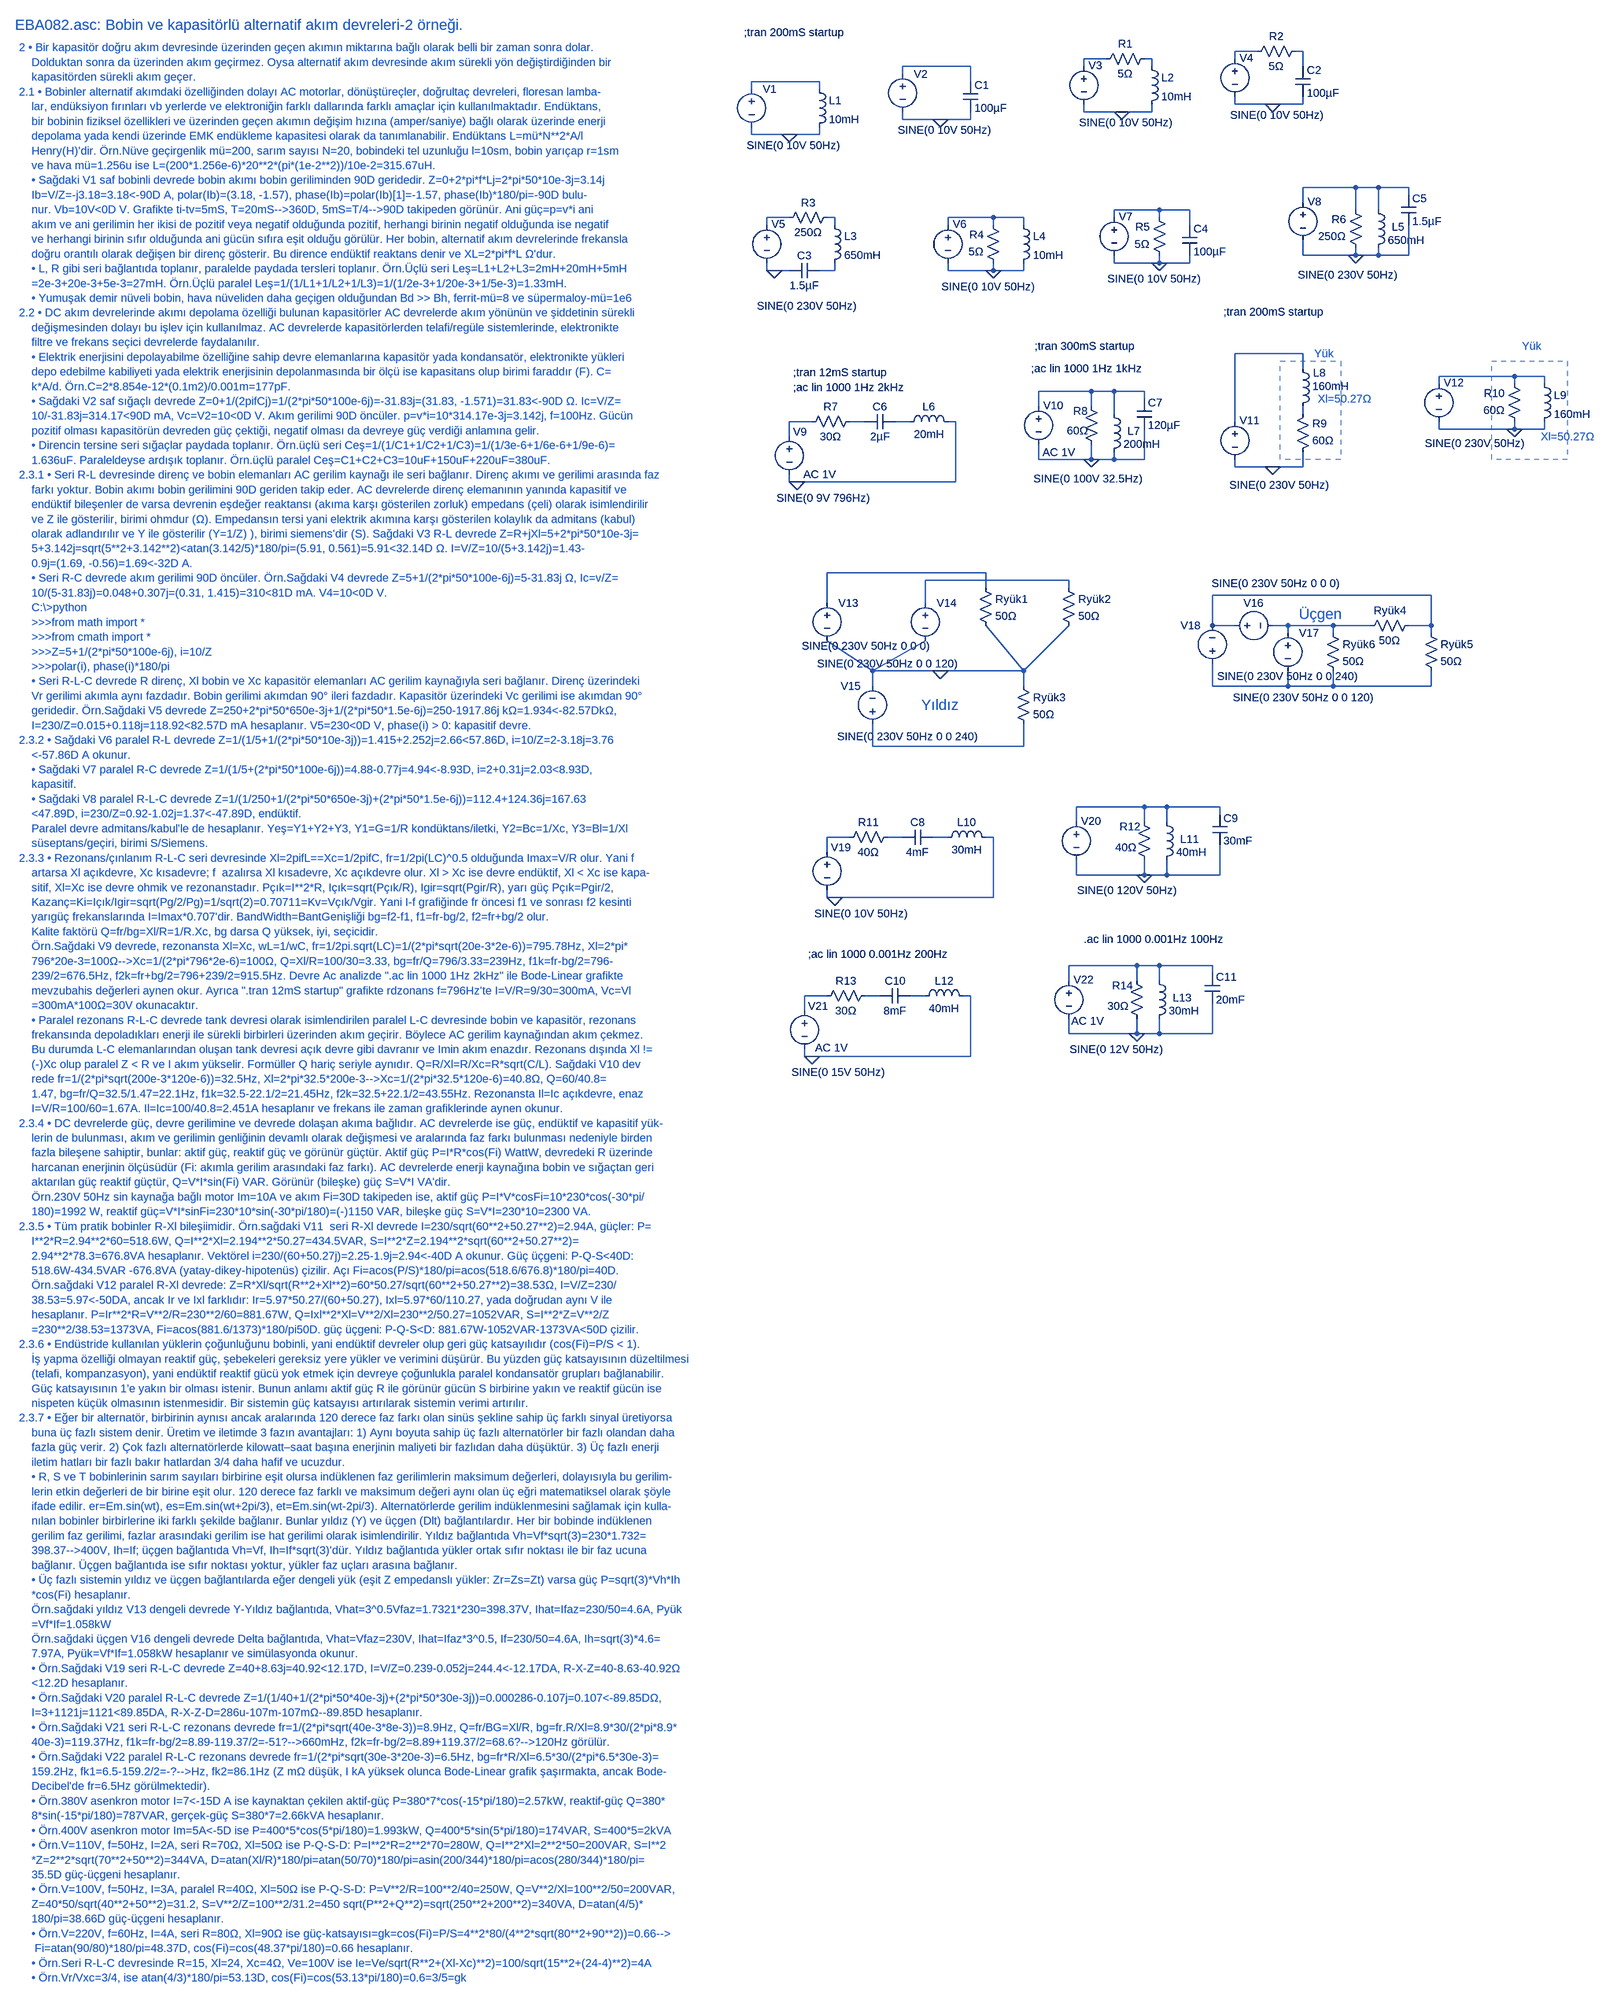
[diagram p0: schematic EBA082.asc]
EBA082.asc, the LTspice schematic file:
Version 4
SHEET 1 4076 3772
WIRE 2592 96 2544 96
WIRE 2688 96 2672 96
WIRE 2272 112 2224 112
WIRE 2368 112 2352 112
WIRE 2544 112 2544 96
WIRE 1984 128 1840 128
WIRE 2224 128 2224 112
WIRE 2368 128 2368 112
WIRE 2688 128 2688 96
WIRE 1840 144 1840 128
WIRE 1664 160 1520 160
WIRE 1984 160 1984 128
WIRE 1520 176 1520 160
WIRE 1664 176 1664 160
WIRE 2544 208 2544 192
WIRE 2624 208 2544 208
WIRE 2688 208 2688 192
WIRE 2688 208 2624 208
WIRE 2224 224 2224 208
WIRE 2304 224 2224 224
WIRE 2368 224 2368 208
WIRE 2368 224 2304 224
WIRE 1840 240 1840 224
WIRE 1920 240 1840 240
WIRE 1984 240 1984 224
WIRE 1984 240 1920 240
WIRE 1520 272 1520 256
WIRE 1600 272 1520 272
WIRE 1664 272 1664 256
WIRE 1664 272 1600 272
WIRE 2800 384 2688 384
WIRE 2848 384 2800 384
WIRE 2912 384 2848 384
WIRE 2912 400 2912 384
WIRE 2688 416 2688 384
WIRE 2384 432 2288 432
WIRE 2448 432 2384 432
WIRE 2800 432 2800 384
WIRE 2848 432 2848 384
WIRE 1600 448 1552 448
WIRE 1696 448 1680 448
WIRE 2032 448 1936 448
WIRE 2096 448 2032 448
WIRE 2288 448 2288 432
WIRE 2384 448 2384 432
WIRE 1552 464 1552 448
WIRE 1696 464 1696 448
WIRE 1936 464 1936 448
WIRE 2032 464 2032 448
WIRE 2096 464 2096 448
WIRE 2448 464 2448 432
WIRE 2688 528 2688 496
WIRE 2800 528 2800 512
WIRE 2800 528 2688 528
WIRE 2848 528 2848 512
WIRE 2848 528 2800 528
WIRE 2912 528 2912 464
WIRE 2912 528 2848 528
WIRE 2288 544 2288 528
WIRE 2384 544 2384 528
WIRE 2384 544 2288 544
WIRE 2448 544 2448 528
WIRE 2448 544 2384 544
WIRE 1552 560 1552 544
WIRE 1568 560 1552 560
WIRE 1600 560 1568 560
WIRE 1696 560 1696 544
WIRE 1696 560 1664 560
WIRE 1936 560 1936 544
WIRE 2032 560 2032 544
WIRE 2032 560 1936 560
WIRE 2096 560 2096 544
WIRE 2096 560 2032 560
WIRE 2688 736 2544 736
WIRE 2688 768 2688 736
WIRE 3136 784 2976 784
WIRE 3200 784 3136 784
WIRE 2976 800 2976 784
WIRE 3136 800 3136 784
WIRE 3200 800 3200 784
WIRE 2240 816 2128 816
WIRE 2288 816 2240 816
WIRE 2352 816 2288 816
WIRE 2352 832 2352 816
WIRE 2128 848 2128 816
WIRE 2240 848 2240 816
WIRE 2288 864 2288 816
WIRE 2688 864 2688 848
WIRE 1648 880 1600 880
WIRE 1760 880 1728 880
WIRE 1856 880 1824 880
WIRE 1952 880 1936 880
WIRE 2544 880 2544 736
WIRE 2976 896 2976 880
WIRE 3136 896 3136 880
WIRE 3136 896 2976 896
WIRE 3200 896 3200 880
WIRE 3200 896 3136 896
WIRE 1600 912 1600 880
WIRE 2128 960 2128 928
WIRE 2240 960 2240 928
WIRE 2240 960 2128 960
WIRE 2288 960 2288 944
WIRE 2288 960 2240 960
WIRE 2352 960 2352 896
WIRE 2352 960 2288 960
WIRE 2544 976 2544 960
WIRE 2624 976 2544 976
WIRE 2688 976 2688 944
WIRE 2688 976 2624 976
WIRE 1600 1008 1600 992
WIRE 1616 1008 1600 1008
WIRE 1952 1008 1952 880
WIRE 1952 1008 1616 1008
WIRE 2016 1200 1680 1200
WIRE 2192 1216 1888 1216
WIRE 2016 1232 2016 1200
WIRE 2192 1232 2192 1216
WIRE 2960 1248 2496 1248
WIRE 1680 1264 1680 1200
WIRE 1888 1264 1888 1216
WIRE 2496 1312 2496 1248
WIRE 2544 1312 2496 1312
WIRE 2656 1312 2624 1312
WIRE 2752 1312 2656 1312
WIRE 2832 1312 2752 1312
WIRE 2960 1312 2960 1248
WIRE 2960 1312 2912 1312
WIRE 2656 1328 2656 1312
WIRE 2752 1328 2752 1312
WIRE 2960 1328 2960 1312
WIRE 1776 1408 1680 1344
WIRE 1776 1408 1888 1344
WIRE 1920 1408 1776 1408
WIRE 2096 1408 2016 1312
WIRE 2096 1408 2192 1312
WIRE 2096 1408 1920 1408
WIRE 1776 1440 1776 1408
WIRE 2096 1440 2096 1408
WIRE 2496 1440 2496 1392
WIRE 2656 1440 2656 1408
WIRE 2656 1440 2496 1440
WIRE 2752 1440 2752 1408
WIRE 2752 1440 2656 1440
WIRE 2960 1440 2960 1408
WIRE 2960 1440 2752 1440
WIRE 1776 1568 1776 1520
WIRE 2096 1568 2096 1520
WIRE 2096 1568 1776 1568
WIRE 2352 1696 2208 1696
WIRE 2400 1696 2352 1696
WIRE 2512 1696 2400 1696
WIRE 2512 1712 2512 1696
WIRE 2208 1728 2208 1696
WIRE 2352 1728 2352 1696
WIRE 2400 1728 2400 1696
WIRE 1728 1760 1680 1760
WIRE 1840 1760 1808 1760
WIRE 1936 1760 1904 1760
WIRE 2032 1760 2016 1760
WIRE 1680 1792 1680 1760
WIRE 2208 1840 2208 1808
WIRE 2352 1840 2352 1808
WIRE 2352 1840 2208 1840
WIRE 2400 1840 2400 1808
WIRE 2400 1840 2352 1840
WIRE 2512 1840 2512 1776
WIRE 2512 1840 2400 1840
WIRE 1680 1888 1680 1872
WIRE 1696 1888 1680 1888
WIRE 2032 1888 2032 1760
WIRE 2032 1888 1696 1888
WIRE 2336 2032 2192 2032
WIRE 2384 2032 2336 2032
WIRE 2496 2032 2384 2032
WIRE 2496 2048 2496 2032
WIRE 2192 2064 2192 2032
WIRE 2336 2064 2336 2032
WIRE 2384 2064 2384 2032
WIRE 1680 2096 1632 2096
WIRE 1792 2096 1760 2096
WIRE 1888 2096 1856 2096
WIRE 1984 2096 1968 2096
WIRE 1632 2128 1632 2096
WIRE 2192 2176 2192 2144
WIRE 2336 2176 2336 2144
WIRE 2336 2176 2192 2176
WIRE 2384 2176 2384 2144
WIRE 2384 2176 2336 2176
WIRE 2496 2176 2496 2112
WIRE 2496 2176 2384 2176
WIRE 1632 2224 1632 2208
WIRE 1648 2224 1632 2224
WIRE 1984 2224 1984 2096
WIRE 1984 2224 1648 2224
FLAG 1600 272 0
FLAG 1920 240 0
FLAG 2304 224 0
FLAG 2624 208 0
FLAG 1568 560 0
FLAG 2032 560 0
FLAG 2384 544 0
FLAG 2800 528 0
FLAG 1616 1008 0
FLAG 2240 960 0
FLAG 2624 976 0
FLAG 3136 896 0
FLAG 1920 1408 0
FLAG 1696 1888 0
FLAG 2352 1840 0
FLAG 1648 2224 0
FLAG 2336 2176 0
SYMBOL voltage 1520 160 R0
WINDOW 3 -10 135 Left 2
WINDOW 123 0 0 Left 0
WINDOW 39 0 0 Left 0
SYMATTR Value SINE(0 10V 50Hz)
SYMATTR InstName V1
SYMBOL ind 1648 160 R0
SYMATTR InstName L1
SYMATTR Value 10mH
SYMBOL voltage 1840 128 R0
WINDOW 3 -10 135 Left 2
WINDOW 123 0 0 Left 0
WINDOW 39 0 0 Left 0
SYMATTR Value SINE(0 10V 50Hz)
SYMATTR InstName V2
SYMBOL cap 1968 160 R0
SYMATTR InstName C1
SYMATTR Value 100µF
SYMBOL voltage 2224 112 R0
WINDOW 3 -10 135 Left 2
WINDOW 123 0 0 Left 0
WINDOW 39 0 0 Left 0
WINDOW 0 10 14 Left 2
SYMATTR Value SINE(0 10V 50Hz)
SYMATTR InstName V3
SYMBOL ind 2352 112 R0
SYMATTR InstName L2
SYMATTR Value 10mH
SYMBOL res 2368 96 R90
WINDOW 0 0 56 VBottom 2
WINDOW 3 32 56 VTop 2
SYMATTR InstName R1
SYMATTR Value 5Ω
SYMBOL voltage 2544 96 R0
WINDOW 3 -10 135 Left 2
WINDOW 123 0 0 Left 0
WINDOW 39 0 0 Left 0
WINDOW 0 10 14 Left 2
SYMATTR Value SINE(0 10V 50Hz)
SYMATTR InstName V4
SYMBOL res 2688 80 R90
WINDOW 0 0 56 VBottom 2
WINDOW 3 32 56 VTop 2
SYMATTR InstName R2
SYMATTR Value 5Ω
SYMBOL cap 2672 128 R0
SYMATTR InstName C2
SYMATTR Value 100µF
SYMBOL voltage 1552 448 R0
WINDOW 3 -21 187 Left 2
WINDOW 123 0 0 Left 0
WINDOW 39 0 0 Left 0
WINDOW 0 10 14 Left 2
SYMATTR Value SINE(0 230V 50Hz)
SYMATTR InstName V5
SYMBOL ind 1680 448 R0
SYMATTR InstName L3
SYMATTR Value 650mH
SYMBOL res 1696 432 R90
WINDOW 0 0 56 VBottom 2
WINDOW 3 32 56 VTop 2
SYMATTR InstName R3
SYMATTR Value 250Ω
SYMBOL cap 1664 544 R90
WINDOW 0 0 32 VBottom 2
WINDOW 3 32 32 VTop 2
SYMATTR InstName C3
SYMATTR Value 1.5µF
SYMBOL voltage 1936 448 R0
WINDOW 3 -14 146 Left 2
WINDOW 123 0 0 Left 0
WINDOW 39 0 0 Left 0
WINDOW 0 10 14 Left 2
SYMATTR Value SINE(0 10V 50Hz)
SYMATTR InstName V6
SYMBOL ind 2080 448 R0
SYMATTR InstName L4
SYMATTR Value 10mH
SYMBOL res 2048 560 R180
WINDOW 0 36 76 Left 2
WINDOW 3 36 40 Left 2
SYMATTR InstName R4
SYMATTR Value 5Ω
SYMBOL voltage 2288 432 R0
WINDOW 3 -14 146 Left 2
WINDOW 123 0 0 Left 0
WINDOW 39 0 0 Left 0
WINDOW 0 10 14 Left 2
SYMATTR Value SINE(0 10V 50Hz)
SYMATTR InstName V7
SYMBOL res 2400 544 R180
WINDOW 0 36 76 Left 2
WINDOW 3 36 40 Left 2
SYMATTR InstName R5
SYMATTR Value 5Ω
SYMBOL cap 2432 464 R0
SYMATTR InstName C4
SYMATTR Value 100µF
SYMBOL voltage 2688 400 R0
WINDOW 3 -11 169 Left 2
WINDOW 123 0 0 Left 0
WINDOW 39 0 0 Left 0
WINDOW 0 10 14 Left 2
SYMATTR Value SINE(0 230V 50Hz)
SYMATTR InstName V8
SYMBOL ind 2832 416 R0
WINDOW 0 44 52 Left 2
SYMATTR InstName L5
SYMATTR Value 650mH
SYMBOL res 2816 528 R180
WINDOW 0 36 76 Left 2
WINDOW 3 36 40 Left 2
SYMATTR InstName R6
SYMATTR Value 250Ω
SYMBOL cap 2896 464 M180
WINDOW 0 24 56 Left 2
WINDOW 3 24 8 Left 2
SYMATTR InstName C5
SYMATTR Value 1.5µF
SYMBOL voltage 1600 896 R0
WINDOW 3 -27 146 Left 2
WINDOW 123 30 96 Left 2
WINDOW 39 0 0 Left 0
WINDOW 0 8 6 Left 2
SYMATTR Value SINE(0 9V 796Hz)
SYMATTR Value2 AC 1V
SYMATTR InstName V9
SYMBOL res 1744 864 R90
WINDOW 0 0 56 VBottom 2
WINDOW 3 32 56 VTop 2
SYMATTR InstName R7
SYMATTR Value 30Ω
SYMBOL cap 1824 864 R90
WINDOW 0 0 32 VBottom 2
WINDOW 3 32 32 VTop 2
SYMATTR InstName C6
SYMATTR Value 2µF
SYMBOL ind 1840 896 R270
WINDOW 0 32 56 VTop 2
WINDOW 3 5 56 VBottom 2
SYMATTR InstName L6
SYMATTR Value 20mH
SYMBOL voltage 2128 832 R0
WINDOW 3 -11 169 Left 2
WINDOW 123 8 113 Left 2
WINDOW 39 0 0 Left 0
WINDOW 0 10 14 Left 2
SYMATTR Value SINE(0 100V 32.5Hz)
SYMATTR Value2 AC 1V
SYMATTR InstName V10
SYMBOL ind 2272 848 R0
WINDOW 0 44 52 Left 2
SYMATTR InstName L7
SYMATTR Value 200mH
SYMBOL res 2256 944 R180
WINDOW 0 24 86 Left 2
WINDOW 3 22 45 Left 2
SYMATTR InstName R8
SYMATTR Value 60Ω
SYMBOL cap 2336 896 M180
WINDOW 0 24 56 Left 2
WINDOW 3 24 8 Left 2
SYMATTR InstName C7
SYMATTR Value 120µF
SYMBOL voltage 2544 864 R0
WINDOW 3 -12 150 Left 2
WINDOW 123 0 0 Left 0
WINDOW 39 0 0 Left 0
WINDOW 0 10 14 Left 2
SYMATTR Value SINE(0 230V 50Hz)
SYMATTR InstName V11
SYMBOL ind 2672 752 R0
WINDOW 0 38 25 Left 2
WINDOW 3 36 53 Left 2
SYMATTR InstName L8
SYMATTR Value 160mH
SYMBOL res 2672 960 M180
WINDOW 0 36 76 Left 2
WINDOW 3 36 40 Left 2
SYMATTR InstName R9
SYMATTR Value 60Ω
SYMBOL voltage 2976 784 R0
WINDOW 3 -30 142 Left 2
WINDOW 123 0 0 Left 0
WINDOW 39 0 0 Left 0
WINDOW 0 10 14 Left 2
SYMATTR Value SINE(0 230V 50Hz)
SYMATTR InstName V12
SYMBOL ind 3184 784 R0
SYMATTR InstName L9
SYMATTR Value 160mH
SYMBOL res 3152 896 R180
WINDOW 0 36 76 Left 2
WINDOW 3 36 40 Left 2
SYMATTR InstName R10
SYMATTR Value 60Ω
SYMBOL voltage 1680 1248 R0
WINDOW 3 -54 107 Left 2
WINDOW 123 0 0 Left 0
WINDOW 39 0 0 Left 0
SYMATTR Value SINE(0 230V 50Hz 0 0 0)
SYMATTR InstName V13
SYMBOL voltage 1888 1248 R0
WINDOW 3 -229 145 Left 2
WINDOW 123 0 0 Left 0
WINDOW 39 0 0 Left 0
SYMATTR Value SINE(0 230V 50Hz 0 0 120)
SYMATTR InstName V14
SYMBOL voltage 1776 1536 R180
WINDOW 0 24 96 Left 2
WINDOW 3 -225 -11 Left 2
WINDOW 123 0 0 Left 0
WINDOW 39 0 0 Left 0
SYMATTR InstName V15
SYMATTR Value SINE(0 230V 50Hz 0 0 240)
SYMBOL res 2000 1216 R0
SYMATTR InstName Ryük1
SYMATTR Value 50Ω
SYMBOL res 2176 1216 R0
SYMATTR InstName Ryük2
SYMATTR Value 50Ω
SYMBOL res 2080 1424 R0
SYMATTR InstName Ryük3
SYMATTR Value 50Ω
SYMBOL res 2928 1296 R90
WINDOW 0 0 56 VBottom 2
WINDOW 3 32 56 VTop 2
SYMATTR InstName Ryük4
SYMATTR Value 50Ω
SYMBOL res 2944 1312 R0
SYMATTR InstName Ryük5
SYMATTR Value 50Ω
SYMBOL res 2736 1312 R0
SYMATTR InstName Ryük6
SYMATTR Value 50Ω
SYMBOL voltage 2528 1312 R270
WINDOW 0 32 56 VTop 2
WINDOW 3 105 103 VBottom 2
WINDOW 123 0 0 Left 0
SYMATTR InstName V16
SYMATTR Value SINE(0 230V 50Hz 0 0 0)
SYMATTR SpiceLine Rser=1u
SYMBOL voltage 2656 1312 R0
WINDOW 3 -116 152 Left 2
WINDOW 123 0 0 Left 0
SYMATTR Value SINE(0 230V 50Hz 0 0 120)
SYMATTR InstName V17
SYMATTR SpiceLine Rser=1u
SYMBOL voltage 2496 1408 R180
WINDOW 0 24 96 Left 2
WINDOW 3 -310 -11 Left 2
WINDOW 123 0 0 Left 0
WINDOW 39 0 0 Left 0
SYMATTR InstName V18
SYMATTR Value SINE(0 230V 50Hz 0 0 240)
SYMBOL voltage 1680 1776 R0
WINDOW 3 -27 146 Left 2
WINDOW 123 30 96 Left 2
WINDOW 39 0 0 Left 0
WINDOW 0 8 6 Left 2
SYMATTR Value SINE(0 10V 50Hz)
SYMATTR InstName V19
SYMBOL res 1824 1744 R90
WINDOW 0 0 56 VBottom 2
WINDOW 3 32 56 VTop 2
SYMATTR InstName R11
SYMATTR Value 40Ω
SYMBOL cap 1904 1744 R90
WINDOW 0 0 32 VBottom 2
WINDOW 3 32 32 VTop 2
SYMATTR InstName C8
SYMATTR Value 4mF
SYMBOL ind 1920 1776 R270
WINDOW 0 32 56 VTop 2
WINDOW 3 5 56 VBottom 2
SYMATTR InstName L10
SYMATTR Value 30mH
SYMBOL voltage 2208 1712 R0
WINDOW 3 2 161 Left 2
WINDOW 123 8 113 Left 2
WINDOW 39 0 0 Left 0
WINDOW 0 10 14 Left 2
SYMATTR Value SINE(0 120V 50Hz)
SYMATTR InstName V20
SYMBOL ind 2384 1712 R0
WINDOW 0 44 52 Left 2
SYMATTR InstName L11
SYMATTR Value 40mH
SYMBOL res 2368 1824 R180
WINDOW 0 24 86 Left 2
WINDOW 3 32 42 Left 2
SYMATTR InstName R12
SYMATTR Value 40Ω
SYMBOL cap 2496 1776 M180
WINDOW 0 24 56 Left 2
WINDOW 3 24 8 Left 2
SYMATTR InstName C9
SYMATTR Value 30mF
SYMBOL voltage 1632 2112 R0
WINDOW 3 -27 146 Left 2
WINDOW 123 23 94 Left 2
WINDOW 39 0 0 Left 0
WINDOW 0 8 6 Left 2
SYMATTR Value SINE(0 15V 50Hz)
SYMATTR Value2 AC 1V
SYMATTR InstName V21
SYMBOL res 1776 2080 R90
WINDOW 0 0 56 VBottom 2
WINDOW 3 32 56 VTop 2
SYMATTR InstName R13
SYMATTR Value 30Ω
SYMBOL cap 1856 2080 R90
WINDOW 0 0 32 VBottom 2
WINDOW 3 32 32 VTop 2
SYMATTR InstName C10
SYMATTR Value 8mF
SYMBOL ind 1872 2112 R270
WINDOW 0 32 56 VTop 2
WINDOW 3 5 56 VBottom 2
SYMATTR InstName L12
SYMATTR Value 40mH
SYMBOL voltage 2192 2048 R0
WINDOW 3 2 161 Left 2
WINDOW 123 5 101 Left 2
WINDOW 39 0 0 Left 0
WINDOW 0 10 14 Left 2
SYMATTR Value SINE(0 12V 50Hz)
SYMATTR Value2 AC 1V
SYMATTR InstName V22
SYMBOL ind 2368 2048 R0
WINDOW 0 44 52 Left 2
SYMATTR InstName L13
SYMATTR Value 30mH
SYMBOL res 2352 2160 R180
WINDOW 0 24 86 Left 2
WINDOW 3 32 42 Left 2
SYMATTR InstName R14
SYMATTR Value 30Ω
SYMBOL cap 2480 2112 M180
WINDOW 0 24 56 Left 2
WINDOW 3 24 8 Left 2
SYMATTR InstName C11
SYMATTR Value 20mF
TEXT -152 40 Left 3 ;EBA082.asc: Bobin ve kapasitörlü alternatif akım devreleri-2 örneği.
TEXT -144 88 Left 2 ;2 • Bir kapasitör doğru akım devresinde üzerinden geçen akımın miktarına bağlı olarak belli bir zaman sonra dolar. \n    Dolduktan sonra da üzerinden akım geçirmez. Oysa alternatif akım devresinde akım sürekli yön değiştirdiğinden bir \n    kapasitörden sürekli akım geçer.\n2.1 • Bobinler alternatif akımdaki özelliğinden dolayı AC motorlar, dönüştüreçler, doğrultaç devreleri, floresan lamba-\n    lar, endüksiyon fırınları vb yerlerde ve elektroniğin farklı dallarında farklı amaçlar için kullanılmaktadır. Endüktans, \n    bir bobinin fiziksel özellikleri ve üzerinden geçen akımın değişim hızına (amper/saniye) bağlı olarak üzerinde enerji\n    depolama yada kendi üzerinde EMK endükleme kapasitesi olarak da tanımlanabilir. Endüktans L=mü*N**2*A/l\n    Henry(H)'dir. Örn.Nüve geçirgenlik mü=200, sarım sayısı N=20, bobindeki tel uzunluğu l=10sm, bobin yarıçap r=1sm\n    ve hava mü=1.256u ise L=(200*1.256e-6)*20**2*(pi*(1e-2**2))/10e-2=315.67uH.\n    • Sağdaki V1 saf bobinli devrede bobin akımı bobin geriliminden 90D geridedir. Z=0+2*pi*f*Lj=2*pi*50*10e-3j=3.14j\n    Ib=V/Z=-j3.18=3.18<-90D A, polar(Ib)=(3.18, -1.57), phase(Ib)=polar(Ib)[1]=-1.57, phase(Ib)*180/pi=-90D bulu-\n    nur. Vb=10V<0D V. Grafikte ti-tv=5mS, T=20mS-->360D, 5mS=T/4-->90D takipeden görünür. Ani güç=p=v*i ani \n    akım ve ani gerilimin her ikisi de pozitif veya negatif olduğunda pozitif, herhangi birinin negatif olduğunda ise negatif\n    ve herhangi birinin sıfır olduğunda ani gücün sıfıra eşit olduğu görülür. Her bobin, alternatif akım devrelerinde frekansla\n    doğru orantılı olarak değişen bir direnç gösterir. Bu dirence endüktif reaktans denir ve XL=2*pi*f*L Ω'dur.\n    • L, R gibi seri bağlantıda toplanır, paralelde paydada tersleri toplanır. Örn.Üçlü seri Leş=L1+L2+L3=2mH+20mH+5mH\n    =2e-3+20e-3+5e-3=27mH. Örn.Üçlü paralel Leş=1/(1/L1+1/L2+1/L3)=1/(1/2e-3+1/20e-3+1/5e-3)=1.33mH.\n    • Yumuşak demir nüveli bobin, hava nüveliden daha geçigen olduğundan Bd >> Bh, ferrit-mü=8 ve süpermaloy-mü=1e6\n2.2 • DC akım devrelerinde akımı depolama özelliği bulunan kapasitörler AC devrelerde akım yönünün ve şiddetinin sürekli \n    değişmesinden dolayı bu işlev için kullanılmaz. AC devrelerde kapasitörlerden telafi/regüle sistemlerinde, elektronikte\n    filtre ve frekans seçici devrelerde faydalanılır.\n    • Elektrik enerjisini depolayabilme özelliğine sahip devre elemanlarına kapasitör yada kondansatör, elektronikte yükleri \n    depo edebilme kabiliyeti yada elektrik enerjisinin depolanmasında bir ölçü ise kapasitans olup birimi faraddır (F). C=\n    k*A/d. Örn.C=2*8.854e-12*(0.1m2)/0.001m=177pF.\n    • Sağdaki V2 saf sığaçlı devrede Z=0+1/(2pifCj)=1/(2*pi*50*100e-6j)=-31.83j=(31.83, -1.571)=31.83<-90D Ω. Ic=V/Z=\n    10/-31.83j=314.17<90D mA, Vc=V2=10<0D V. Akım gerilimi 90D öncüler. p=v*i=10*314.17e-3j=3.142j, f=100Hz. Gücün\n    pozitif olması kapasitörün devreden güç çektiği, negatif olması da devreye güç verdiği anlamına gelir.\n    • Direncin tersine seri sığaçlar paydada toplanır. Örn.üçlü seri Ceş=1/(1/C1+1/C2+1/C3)=1/(1/3e-6+1/6e-6+1/9e-6)=\n    1.636uF. Paraleldeyse ardışık toplanır. Örn.üçlü paralel Ceş=C1+C2+C3=10uF+150uF+220uF=380uF.\n2.3.1 • Seri R-L devresinde direnç ve bobin elemanları AC gerilim kaynağı ile seri bağlanır. Direnç akımı ve gerilimi arasında faz\n    farkı yoktur. Bobin akımı bobin gerilimini 90D geriden takip eder. AC devrelerde direnç elemanının yanında kapasitif ve\n    endüktif bileşenler de varsa devrenin eşdeğer reaktansı (akıma karşı gösterilen zorluk) empedans (çeli) olarak isimlendirilir\n    ve Z ile gösterilir, birimi ohmdur (Ω). Empedansın tersi yani elektrik akımına karşı gösterilen kolaylık da admitans (kabul)\n    olarak adlandırılır ve Y ile gösterilir (Y=1/Z) ), birimi siemens'dir (S). Sağdaki V3 R-L devrede Z=R+jXl=5+2*pi*50*10e-3j=\n    5+3.142j=sqrt(5**2+3.142**2)<atan(3.142/5)*180/pi=(5.91, 0.561)=5.91<32.14D Ω. I=V/Z=10/(5+3.142j)=1.43-\n    0.9j=(1.69, -0.56)=1.69<-32D A.\n    • Seri R-C devrede akım gerilimi 90D öncüler. Örn.Sağdaki V4 devrede Z=5+1/(2*pi*50*100e-6j)=5-31.83j Ω, Ic=v/Z=\n    10/(5-31.83j)=0.048+0.307j=(0.31, 1.415)=310<81D mA. V4=10<0D V.\n    C:\\>python\n    >>>from math import *\n    >>>from cmath import *\n    >>>Z=5+1/(2*pi*50*100e-6j), i=10/Z\n    >>>polar(i), phase(i)*180/pi\n    • Seri R-L-C devrede R direnç, Xl bobin ve Xc kapasitör elemanları AC gerilim kaynağıyla seri bağlanır. Direnç üzerindeki\n    Vr gerilimi akımla aynı fazdadır. Bobin gerilimi akımdan 90° ileri fazdadır. Kapasitör üzerindeki Vc gerilimi ise akımdan 90° \n    geridedir. Örn.Sağdaki V5 devrede Z=250+2*pi*50*650e-3j+1/(2*pi*50*1.5e-6j)=250-1917.86j kΩ=1.934<-82.57DkΩ, \n    I=230/Z=0.015+0.118j=118.92<82.57D mA hesaplanır. V5=230<0D V, phase(i) > 0: kapasitif devre.\n2.3.2 • Sağdaki V6 paralel R-L devrede Z=1/(1/5+1/(2*pi*50*10e-3j))=1.415+2.252j=2.66<57.86D, i=10/Z=2-3.18j=3.76\n    <-57.86D A okunur.\n    • Sağdaki V7 paralel R-C devrede Z=1/(1/5+(2*pi*50*100e-6j))=4.88-0.77j=4.94<-8.93D, i=2+0.31j=2.03<8.93D,\n    kapasitif.\n    • Sağdaki V8 paralel R-L-C devrede Z=1/(1/250+1/(2*pi*50*650e-3j)+(2*pi*50*1.5e-6j))=112.4+124.36j=167.63\n    <47.89D, i=230/Z=0.92-1.02j=1.37<-47.89D, endüktif.\n    Paralel devre admitans/kabul'le de hesaplanır. Yeş=Y1+Y2+Y3, Y1=G=1/R kondüktans/iletki, Y2=Bc=1/Xc, Y3=Bl=1/Xl \n    süseptans/geçiri, birimi S/Siemens.\n2.3.3 • Rezonans/çınlanım R-L-C seri devresinde Xl=2pifL==Xc=1/2pifC, fr=1/2pi(LC)^0.5 olduğunda Imax=V/R olur. Yani f\n    artarsa Xl açıkdevre, Xc kısadevre; f  azalırsa Xl kısadevre, Xc açıkdevre olur. Xl > Xc ise devre endüktif, Xl < Xc ise kapa-\n    sitif, Xl=Xc ise devre ohmik ve rezonanstadır. Pçık=I**2*R, Içık=sqrt(Pçık/R), Igir=sqrt(Pgir/R), yarı güç Pçık=Pgir/2, \n    Kazanç=Ki=Içık/Igir=sqrt(Pg/2/Pg)=1/sqrt(2)=0.70711=Kv=Vçık/Vgir. Yani I-f grafiğinde fr öncesi f1 ve sonrası f2 kesinti\n    yarıgüç frekanslarında I=Imax*0.707'dir. BandWidth=BantGenişliği bg=f2-f1, f1=fr-bg/2, f2=fr+bg/2 olur.\n    Kalite faktörü Q=fr/bg=Xl/R=1/R.Xc, bg darsa Q yüksek, iyi, seçicidir.\n    Örn.Sağdaki V9 devrede, rezonansta Xl=Xc, wL=1/wC, fr=1/2pi.sqrt(LC)=1/(2*pi*sqrt(20e-3*2e-6))=795.78Hz, Xl=2*pi*\n    796*20e-3=100Ω-->Xc=1/(2*pi*796*2e-6)=100Ω, Q=Xl/R=100/30=3.33, bg=fr/Q=796/3.33=239Hz, f1k=fr-bg/2=796-\n    239/2=676.5Hz, f2k=fr+bg/2=796+239/2=915.5Hz. Devre Ac analizde ".ac lin 1000 1Hz 2kHz" ile Bode-Linear grafikte\n    mevzubahis değerleri aynen okur. Ayrıca ".tran 12mS startup" grafikte rdzonans f=796Hz'te I=V/R=9/30=300mA, Vc=Vl\n    =300mA*100Ω=30V okunacaktır.\n    • Paralel rezonans R-L-C devrede tank devresi olarak isimlendirilen paralel L-C devresinde bobin ve kapasitör, rezonans \n    frekansında depoladıkları enerji ile sürekli birbirleri üzerinden akım geçirir. Böylece AC gerilim kaynağından akım çekmez. \n    Bu durumda L-C elemanlarından oluşan tank devresi açık devre gibi davranır ve Imin akım enazdır. Rezonans dışında Xl != \n    (-)Xc olup paralel Z < R ve I akım yükselir. Formüller Q hariç seriyle aynıdır. Q=R/Xl=R/Xc=R*sqrt(C/L). Sağdaki V10 dev\n    rede fr=1/(2*pi*sqrt(200e-3*120e-6))=32.5Hz, Xl=2*pi*32.5*200e-3-->Xc=1/(2*pi*32.5*120e-6)=40.8Ω, Q=60/40.8=\n    1.47, bg=fr/Q=32.5/1.47=22.1Hz, f1k=32.5-22.1/2=21.45Hz, f2k=32.5+22.1/2=43.55Hz. Rezonansta Il=Ic açıkdevre, enaz\n    I=V/R=100/60=1.67A. Il=Ic=100/40.8=2.451A hesaplanır ve frekans ile zaman grafiklerinde aynen okunur.\n2.3.4 • DC devrelerde güç, devre gerilimine ve devrede dolaşan akıma bağlıdır. AC devrelerde ise güç, endüktif ve kapasitif yük-\n    lerin de bulunması, akım ve gerilimin genliğinin devamlı olarak değişmesi ve aralarında faz farkı bulunması nedeniyle birden\n    fazla bileşene sahiptir, bunlar: aktif güç, reaktif güç ve görünür güçtür. Aktif güç P=I*R*cos(Fi) WattW, devredeki R üzerinde\n    harcanan enerjinin ölçüsüdür (Fi: akımla gerilim arasındaki faz farkı). AC devrelerde enerji kaynağına bobin ve sığaçtan geri \n    aktarılan güç reaktif güçtür, Q=V*I*sin(Fi) VAR. Görünür (bileşke) güç S=V*I VA'dir.\n    Örn.230V 50Hz sin kaynağa bağlı motor Im=10A ve akım Fi=30D takipeden ise, aktif güç P=I*V*cosFi=10*230*cos(-30*pi/\n    180)=1992 W, reaktif güç=V*I*sinFi=230*10*sin(-30*pi/180)=(-)1150 VAR, bileşke güç S=V*I=230*10=2300 VA.\n2.3.5 • Tüm pratik bobinler R-Xl bileşiimidir. Örn.sağdaki V11  seri R-Xl devrede I=230/sqrt(60**2+50.27**2)=2.94A, güçler: P=\n    I**2*R=2.94**2*60=518.6W, Q=I**2*Xl=2.194**2*50.27=434.5VAR, S=I**2*Z=2.194**2*sqrt(60**2+50.27**2)=\n    2.94**2*78.3=676.8VA hesaplanır. Vektörel i=230/(60+50.27j)=2.25-1.9j=2.94<-40D A okunur. Güç üçgeni: P-Q-S<40D:\n    518.6W-434.5VAR -676.8VA (yatay-dikey-hipotenüs) çizilir. Açı Fi=acos(P/S)*180/pi=acos(518.6/676.8)*180/pi=40D.\n    Örn.sağdaki V12 paralel R-Xl devrede: Z=R*Xl/sqrt(R**2+Xl**2)=60*50.27/sqrt(60**2+50.27**2)=38.53Ω, I=V/Z=230/\n    38.53=5.97<-50DA, ancak Ir ve Ixl farklıdır: Ir=5.97*50.27/(60+50.27), Ixl=5.97*60/110.27, yada doğrudan aynı V ile \n    hesaplanır. P=Ir**2*R=V**2/R=230**2/60=881.67W, Q=Ixl**2*Xl=V**2/Xl=230**2/50.27=1052VAR, S=I**2*Z=V**2/Z\n    =230**2/38.53=1373VA, Fi=acos(881.6/1373)*180/pi50D. güç üçgeni: P-Q-S<D: 881.67W-1052VAR-1373VA<50D çizilir.\n2.3.6 • Endüstride kullanılan yüklerin çoğunluğunu bobinli, yani endüktif devreler olup geri güç katsayılıdır (cos(Fi)=P/S < 1).\n    İş yapma özelliği olmayan reaktif güç, şebekeleri gereksiz yere yükler ve verimini düşürür. Bu yüzden güç katsayısının düzeltilmesi\n    (telafi, kompanzasyon), yani endüktif reaktif gücü yok etmek için devreye çoğunlukla paralel kondansatör grupları bağlanabilir.\n    Güç katsayısının 1’e yakın bir olması istenir. Bunun anlamı aktif güç R ile görünür gücün S birbirine yakın ve reaktif gücün ise \n    nispeten küçük olmasının istenmesidir. Bir sistemin güç katsayısı artırılarak sistemin verimi artırılır.\n2.3.7 • Eğer bir alternatör, birbirinin aynısı ancak aralarında 120 derece faz farkı olan sinüs şekline sahip üç farklı sinyal üretiyorsa\n    buna üç fazlı sistem denir. Üretim ve iletimde 3 fazın avantajları: 1) Aynı boyuta sahip üç fazlı alternatörler bir fazlı olandan daha \n    fazla güç verir. 2) Çok fazlı alternatörlerde kilowatt–saat başına enerjinin maliyeti bir fazlıdan daha düşüktür. 3) Üç fazlı enerji\n    iletim hatları bir fazlı bakır hatlardan 3/4 daha hafif ve ucuzdur.\n    • R, S ve T bobinlerinin sarım sayıları birbirine eşit olursa indüklenen faz gerilimlerin maksimum değerleri, dolayısıyla bu gerilim-\n    lerin etkin değerleri de bir birine eşit olur. 120 derece faz farklı ve maksimum değeri aynı olan üç eğri matematiksel olarak şöyle\n    ifade edilir. er=Em.sin(wt), es=Em.sin(wt+2pi/3), et=Em.sin(wt-2pi/3). Alternatörlerde gerilim indüklenmesini sağlamak için kulla-\n    nılan bobinler birbirlerine iki farklı şekilde bağlanır. Bunlar yıldız (Y) ve üçgen (Dlt) bağlantılardır. Her bir bobinde indüklenen \n    gerilim faz gerilimi, fazlar arasındaki gerilim ise hat gerilimi olarak isimlendirilir. Yıldız bağlantıda Vh=Vf*sqrt(3)=230*1.732=\n    398.37-->400V, Ih=If; üçgen bağlantıda Vh=Vf, Ih=If*sqrt(3)'dür. Yıldız bağlantıda yükler ortak sıfır noktası ile bir faz ucuna \n    bağlanır. Üçgen bağlantıda ise sıfır noktası yoktur, yükler faz uçları arasına bağlanır.\n    • Üç fazlı sistemin yıldız ve üçgen bağlantılarda eğer dengeli yük (eşit Z empedanslı yükler: Zr=Zs=Zt) varsa güç P=sqrt(3)*Vh*Ih\n    *cos(Fi) hesaplanır.\n    Örn.sağdaki yıldız V13 dengeli devrede Y-Yıldız bağlantıda, Vhat=3^0.5Vfaz=1.7321*230=398.37V, Ihat=Ifaz=230/50=4.6A, Pyük\n    =Vf*If=1.058kW\n    Örn.sağdaki üçgen V16 dengeli devrede Delta bağlantıda, Vhat=Vfaz=230V, Ihat=Ifaz*3^0.5, If=230/50=4.6A, Ih=sqrt(3)*4.6=\n    7.97A, Pyük=Vf*If=1.058kW hesaplanır ve simülasyonda okunur.\n    • Örn.Sağdaki V19 seri R-L-C devrede Z=40+8.63j=40.92<12.17D, I=V/Z=0.239-0.052j=244.4<-12.17DA, R-X-Z=40-8.63-40.92Ω\n    <12.2D hesaplanır.\n    • Örn.Sağdaki V20 paralel R-L-C devrede Z=1/(1/40+1/(2*pi*50*40e-3j)+(2*pi*50*30e-3j))=0.000286-0.107j=0.107<-89.85DΩ,\n    I=3+1121j=1121<89.85DA, R-X-Z-D=286u-107m-107mΩ--89.85D hesaplanır.\n    • Örn.Sağdaki V21 seri R-L-C rezonans devrede fr=1/(2*pi*sqrt(40e-3*8e-3))=8.9Hz, Q=fr/BG=Xl/R, bg=fr.R/Xl=8.9*30/(2*pi*8.9*\n    40e-3)=119.37Hz, f1k=fr-bg/2=8.89-119.37/2=-51?-->660mHz, f2k=fr-bg/2=8.89+119.37/2=68.6?-->120Hz görülür.\n    • Örn.Sağdaki V22 paralel R-L-C rezonans devrede fr=1/(2*pi*sqrt(30e-3*20e-3)=6.5Hz, bg=fr*R/Xl=6.5*30/(2*pi*6.5*30e-3)=\n    159.2Hz, fk1=6.5-159.2/2=-?-->Hz, fk2=86.1Hz (Z mΩ düşük, I kA yüksek olunca Bode-Linear grafik şaşırmakta, ancak Bode-\n    Decibel'de fr=6.5Hz görülmektedir).\n    • Örn.380V asenkron motor I=7<-15D A ise kaynaktan çekilen aktif-güç P=380*7*cos(-15*pi/180)=2.57kW, reaktif-güç Q=380*\n    8*sin(-15*pi/180)=787VAR, gerçek-güç S=380*7=2.66kVA hesaplanır.\n    • Örn.400V asenkron motor Im=5A<-5D ise P=400*5*cos(5*pi/180)=1.993kW, Q=400*5*sin(5*pi/180)=174VAR, S=400*5=2kVA\n    • Örn.V=110V, f=50Hz, I=2A, seri R=70Ω, Xl=50Ω ise P-Q-S-D: P=I**2*R=2**2*70=280W, Q=I**2*Xl=2**2*50=200VAR, S=I**2\n    *Z=2**2*sqrt(70**2+50**2)=344VA, D=atan(Xl/R)*180/pi=atan(50/70)*180/pi=asin(200/344)*180/pi=acos(280/344)*180/pi=\n    35.5D güç-üçgeni hesaplanır.\n    • Örn.V=100V, f=50Hz, I=3A, paralel R=40Ω, Xl=50Ω ise P-Q-S-D: P=V**2/R=100**2/40=250W, Q=V**2/Xl=100**2/50=200VAR,\n    Z=40*50/sqrt(40**2+50**2)=31.2, S=V**2/Z=100**2/31.2=450 sqrt(P**2+Q**2)=sqrt(250**2+200**2)=340VA, D=atan(4/5)*\n    180/pi=38.66D güç-üçgeni hesaplanır.\n    • Örn.V=220V, f=60Hz, I=4A, seri R=80Ω, Xl=90Ω ise güç-katsayısı=gk=cos(Fi)=P/S=4**2*80/(4**2*sqrt(80**2+90**2))=0.66-->\n     Fi=atan(90/80)*180/pi=48.37D, cos(Fi)=cos(48.37*pi/180)=0.66 hesaplanır.\n    • Örn.Seri R-L-C devresinde R=15, Xl=24, Xc=4Ω, Ve=100V ise Ie=Ve/sqrt(R**2+(Xl-Xc)**2)=100/sqrt(15**2+(24-4)**2)=4A\n    • Örn.Vr/Vxc=3/4, ise atan(4/3)*180/pi=53.13D, cos(Fi)=cos(53.13*pi/180)=0.6=3/5=gk
TEXT 1504 56 Left 2 !;tran 200mS startup
TEXT 1608 808 Left 2 !;ac lin 1000 1Hz 2kHz
TEXT 1608 776 Left 2 !;tran 12mS startup
TEXT 2112 768 Left 2 !;ac lin 1000 1Hz 1kHz
TEXT 2120 720 Left 2 !;tran 300mS startup
TEXT 2520 648 Left 2 !;tran 200mS startup
TEXT 2720 832 Left 2 ;Xl=50.27Ω
TEXT 2712 736 Left 2 ;Yük
TEXT 3152 720 Left 2 ;Yük
TEXT 3192 912 Left 2 ;Xl=50.27Ω
TEXT 1880 1480 Left 3 ;Yıldız
TEXT 2680 1288 Left 3 ;Üçgen
TEXT 1640 2008 Left 2 !;ac lin 1000 0.001Hz 200Hz
TEXT 2224 1976 Left 2 !.ac lin 1000 0.001Hz 100Hz
RECTANGLE Normal 2768 960 2640 752 2
RECTANGLE Normal 3248 960 3088 752 2

The netlist it stands for:
* EBA082.asc
V1 N006 0 SINE(0 10V 50Hz)
L1 N006 0 10mH
V2 N005 0 SINE(0 10V 50Hz)
C1 N005 0 100µF
V3 N003 0 SINE(0 10V 50Hz)
L2 N004 0 10mH
R1 N004 N003 5Ω
V4 N001 0 SINE(0 10V 50Hz)
R2 N002 N001 5Ω
C2 N002 0 100µF
V5 N009 0 SINE(0 230V 50Hz)
L3 N010 N012 650mH
R3 N010 N009 250Ω
C3 N012 0 1.5µF
V6 N011 0 SINE(0 10V 50Hz)
L4 N011 0 10mH
R4 0 N011 5Ω
V7 N008 0 SINE(0 10V 50Hz)
R5 0 N008 5Ω
C4 N008 0 100µF
V8 N007 0 SINE(0 230V 50Hz)
L5 N007 0 650mH
R6 0 N007 250Ω
C5 0 N007 1.5µF
V9 N017 0 SINE(0 9V 796Hz) AC 1V
R7 N018 N017 30Ω
C6 N019 N018 2µF
L6 N019 0 20mH
V10 N015 0 SINE(0 100V 32.5Hz) AC 1V
L7 N015 0 200mH
R8 0 N015 60Ω
C7 0 N015 120µF
V11 N013 0 SINE(0 230V 50Hz)
L8 N013 N016 160mH
R9 0 N016 60Ω
V12 N014 0 SINE(0 230V 50Hz)
L9 N014 0 160mH
R10 0 N014 60Ω
V13 N020 0 SINE(0 230V 50Hz 0 0 0)
V14 N021 0 SINE(0 230V 50Hz 0 0 120)
V15 N025 0 SINE(0 230V 50Hz 0 0 240)
Ryük1 N020 0 50Ω
Ryük2 N021 0 50Ω
Ryük3 0 N025 50Ω
Ryük4 N022 N023 50Ω
Ryük5 N022 N024 50Ω
Ryük6 N023 N024 50Ω
V16 N022 N023 SINE(0 230V 50Hz 0 0 0) Rser=1u
V17 N023 N024 SINE(0 230V 50Hz 0 0 120) Rser=1u
V18 N024 N022 SINE(0 230V 50Hz 0 0 240)
V19 N027 0 SINE(0 10V 50Hz)
R11 N028 N027 40Ω
C8 N029 N028 4mF
L10 N029 0 30mH
V20 N026 0 SINE(0 120V 50Hz)
L11 N026 0 40mH
R12 0 N026 40Ω
C9 0 N026 30mF
V21 N031 0 SINE(0 15V 50Hz) AC 1V
R13 N032 N031 30Ω
C10 N033 N032 8mF
L12 N033 0 40mH
V22 N030 0 SINE(0 12V 50Hz) AC 1V
L13 N030 0 30mH
R14 0 N030 30Ω
C11 0 N030 20mF
* EBA082.asc: Bobin ve kapasitörlü alternatif akım devreleri-2 örneği.
* 2 • Bir kapasitör doğru akım devresinde üzerinden geçen akımın miktarına bağlı olarak belli bir zaman sonra dolar.
*     Dolduktan sonra da üzerinden akım geçirmez. Oysa alternatif akım devresinde akım sürekli yön değiştirdiğinden bir
*     kapasitörden sürekli akım geçer.
* 2.1 • Bobinler alternatif akımdaki özelliğinden dolayı AC motorlar, dönüştüreçler, doğrultaç devreleri, floresan lamba-
*     lar, endüksiyon fırınları vb yerlerde ve elektroniğin farklı dallarında farklı amaçlar için kullanılmaktadır. Endüktans,
*     bir bobinin fiziksel özellikleri ve üzerinden geçen akımın değişim hızına (amper/saniye) bağlı olarak üzerinde enerji
*     depolama yada kendi üzerinde EMK endükleme kapasitesi olarak da tanımlanabilir. Endüktans L=mü*N**2*A/l
*     Henry(H)'dir. Örn.Nüve geçirgenlik mü=200, sarım sayısı N=20, bobindeki tel uzunluğu l=10sm, bobin yarıçap r=1sm
*     ve hava mü=1.256u ise L=(200*1.256e-6)*20**2*(pi*(1e-2**2))/10e-2=315.67uH.
*     • Sağdaki V1 saf bobinli devrede bobin akımı bobin geriliminden 90D geridedir. Z=0+2*pi*f*Lj=2*pi*50*10e-3j=3.14j
*     Ib=V/Z=-j3.18=3.18<-90D A, polar(Ib)=(3.18, -1.57), phase(Ib)=polar(Ib)[1]=-1.57, phase(Ib)*180/pi=-90D bulu-
*     nur. Vb=10V<0D V. Grafikte ti-tv=5mS, T=20mS-->360D, 5mS=T/4-->90D takipeden görünür. Ani güç=p=v*i ani
*     akım ve ani gerilimin her ikisi de pozitif veya negatif olduğunda pozitif, herhangi birinin negatif olduğunda ise negatif
*     ve herhangi birinin sıfır olduğunda ani gücün sıfıra eşit olduğu görülür. Her bobin, alternatif akım devrelerinde frekansla
*     doğru orantılı olarak değişen bir direnç gösterir. Bu dirence endüktif reaktans denir ve XL=2*pi*f*L Ω'dur.
*     • L, R gibi seri bağlantıda toplanır, paralelde paydada tersleri toplanır. Örn.Üçlü seri Leş=L1+L2+L3=2mH+20mH+5mH
*     =2e-3+20e-3+5e-3=27mH. Örn.Üçlü paralel Leş=1/(1/L1+1/L2+1/L3)=1/(1/2e-3+1/20e-3+1/5e-3)=1.33mH.
*     • Yumuşak demir nüveli bobin, hava nüveliden daha geçigen olduğundan Bd >> Bh, ferrit-mü=8 ve süpermaloy-mü=1e6
* 2.2 • DC akım devrelerinde akımı depolama özelliği bulunan kapasitörler AC devrelerde akım yönünün ve şiddetinin sürekli
*     değişmesinden dolayı bu işlev için kullanılmaz. AC devrelerde kapasitörlerden telafi/regüle sistemlerinde, elektronikte
*     filtre ve frekans seçici devrelerde faydalanılır.
*     • Elektrik enerjisini depolayabilme özelliğine sahip devre elemanlarına kapasitör yada kondansatör, elektronikte yükleri
*     depo edebilme kabiliyeti yada elektrik enerjisinin depolanmasında bir ölçü ise kapasitans olup birimi faraddır (F). C=
*     k*A/d. Örn.C=2*8.854e-12*(0.1m2)/0.001m=177pF.
*     • Sağdaki V2 saf sığaçlı devrede Z=0+1/(2pifCj)=1/(2*pi*50*100e-6j)=-31.83j=(31.83, -1.571)=31.83<-90D Ω. Ic=V/Z=
*     10/-31.83j=314.17<90D mA, Vc=V2=10<0D V. Akım gerilimi 90D öncüler. p=v*i=10*314.17e-3j=3.142j, f=100Hz. Gücün
*     pozitif olması kapasitörün devreden güç çektiği, negatif olması da devreye güç verdiği anlamına gelir.
*     • Direncin tersine seri sığaçlar paydada toplanır. Örn.üçlü seri Ceş=1/(1/C1+1/C2+1/C3)=1/(1/3e-6+1/6e-6+1/9e-6)=
*     1.636uF. Paraleldeyse ardışık toplanır. Örn.üçlü paralel Ceş=C1+C2+C3=10uF+150uF+220uF=380uF.
* 2.3.1 • Seri R-L devresinde direnç ve bobin elemanları AC gerilim kaynağı ile seri bağlanır. Direnç akımı ve gerilimi arasında faz
*     farkı yoktur. Bobin akımı bobin gerilimini 90D geriden takip eder. AC devrelerde direnç elemanının yanında kapasitif ve
*     endüktif bileşenler de varsa devrenin eşdeğer reaktansı (akıma karşı gösterilen zorluk) empedans (çeli) olarak isimlendirilir
*     ve Z ile gösterilir, birimi ohmdur (Ω). Empedansın tersi yani elektrik akımına karşı gösterilen kolaylık da admitans (kabul)
*     olarak adlandırılır ve Y ile gösterilir (Y=1/Z) ), birimi siemens'dir (S). Sağdaki V3 R-L devrede Z=R+jXl=5+2*pi*50*10e-3j=
*     5+3.142j=sqrt(5**2+3.142**2)<atan(3.142/5)*180/pi=(5.91, 0.561)=5.91<32.14D Ω. I=V/Z=10/(5+3.142j)=1.43-
*     0.9j=(1.69, -0.56)=1.69<-32D A.
*     • Seri R-C devrede akım gerilimi 90D öncüler. Örn.Sağdaki V4 devrede Z=5+1/(2*pi*50*100e-6j)=5-31.83j Ω, Ic=v/Z=
*     10/(5-31.83j)=0.048+0.307j=(0.31, 1.415)=310<81D mA. V4=10<0D V.
*     C:\>python
*     >>>from math import *
*     >>>from cmath import *
*     >>>Z=5+1/(2*pi*50*100e-6j), i=10/Z
*     >>>polar(i), phase(i)*180/pi
*     • Seri R-L-C devrede R direnç, Xl bobin ve Xc kapasitör elemanları AC gerilim kaynağıyla seri bağlanır. Direnç üzerindeki
*     Vr gerilimi akımla aynı fazdadır. Bobin gerilimi akımdan 90° ileri fazdadır. Kapasitör üzerindeki Vc gerilimi ise akımdan 90°
*     geridedir. Örn.Sağdaki V5 devrede Z=250+2*pi*50*650e-3j+1/(2*pi*50*1.5e-6j)=250-1917.86j kΩ=1.934<-82.57DkΩ,
*     I=230/Z=0.015+0.118j=118.92<82.57D mA hesaplanır. V5=230<0D V, phase(i) > 0: kapasitif devre.
* 2.3.2 • Sağdaki V6 paralel R-L devrede Z=1/(1/5+1/(2*pi*50*10e-3j))=1.415+2.252j=2.66<57.86D, i=10/Z=2-3.18j=3.76
*     <-57.86D A okunur.
*     • Sağdaki V7 paralel R-C devrede Z=1/(1/5+(2*pi*50*100e-6j))=4.88-0.77j=4.94<-8.93D, i=2+0.31j=2.03<8.93D,
*     kapasitif.
*     • Sağdaki V8 paralel R-L-C devrede Z=1/(1/250+1/(2*pi*50*650e-3j)+(2*pi*50*1.5e-6j))=112.4+124.36j=167.63
*     <47.89D, i=230/Z=0.92-1.02j=1.37<-47.89D, endüktif.
*     Paralel devre admitans/kabul'le de hesaplanır. Yeş=Y1+Y2+Y3, Y1=G=1/R kondüktans/iletki, Y2=Bc=1/Xc, Y3=Bl=1/Xl
*     süseptans/geçiri, birimi S/Siemens.
* 2.3.3 • Rezonans/çınlanım R-L-C seri devresinde Xl=2pifL==Xc=1/2pifC, fr=1/2pi(LC)^0.5 olduğunda Imax=V/R olur. Yani f
*     artarsa Xl açıkdevre, Xc kısadevre; f  azalırsa Xl kısadevre, Xc açıkdevre olur. Xl > Xc ise devre endüktif, Xl < Xc ise kapa-
*     sitif, Xl=Xc ise devre ohmik ve rezonanstadır. Pçık=I**2*R, Içık=sqrt(Pçık/R), Igir=sqrt(Pgir/R), yarı güç Pçık=Pgir/2,
*     Kazanç=Ki=Içık/Igir=sqrt(Pg/2/Pg)=1/sqrt(2)=0.70711=Kv=Vçık/Vgir. Yani I-f grafiğinde fr öncesi f1 ve sonrası f2 kesinti
*     yarıgüç frekanslarında I=Imax*0.707'dir. BandWidth=BantGenişliği bg=f2-f1, f1=fr-bg/2, f2=fr+bg/2 olur.
*     Kalite faktörü Q=fr/bg=Xl/R=1/R.Xc, bg darsa Q yüksek, iyi, seçicidir.
*     Örn.Sağdaki V9 devrede, rezonansta Xl=Xc, wL=1/wC, fr=1/2pi.sqrt(LC)=1/(2*pi*sqrt(20e-3*2e-6))=795.78Hz, Xl=2*pi*
*     796*20e-3=100Ω-->Xc=1/(2*pi*796*2e-6)=100Ω, Q=Xl/R=100/30=3.33, bg=fr/Q=796/3.33=239Hz, f1k=fr-bg/2=796-
*     239/2=676.5Hz, f2k=fr+bg/2=796+239/2=915.5Hz. Devre Ac analizde ".ac lin 1000 1Hz 2kHz" ile Bode-Linear grafikte
*     mevzubahis değerleri aynen okur. Ayrıca ".tran 12mS startup" grafikte rdzonans f=796Hz'te I=V/R=9/30=300mA, Vc=Vl
*     =300mA*100Ω=30V okunacaktır.
*     • Paralel rezonans R-L-C devrede tank devresi olarak isimlendirilen paralel L-C devresinde bobin ve kapasitör, rezonans
*     frekansında depoladıkları enerji ile sürekli birbirleri üzerinden akım geçirir. Böylece AC gerilim kaynağından akım çekmez.
*     Bu durumda L-C elemanlarından oluşan tank devresi açık devre gibi davranır ve Imin akım enazdır. Rezonans dışında Xl !=
*     (-)Xc olup paralel Z < R ve I akım yükselir. Formüller Q hariç seriyle aynıdır. Q=R/Xl=R/Xc=R*sqrt(C/L). Sağdaki V10 dev
*     rede fr=1/(2*pi*sqrt(200e-3*120e-6))=32.5Hz, Xl=2*pi*32.5*200e-3-->Xc=1/(2*pi*32.5*120e-6)=40.8Ω, Q=60/40.8=
*     1.47, bg=fr/Q=32.5/1.47=22.1Hz, f1k=32.5-22.1/2=21.45Hz, f2k=32.5+22.1/2=43.55Hz. Rezonansta Il=Ic açıkdevre, enaz
*     I=V/R=100/60=1.67A. Il=Ic=100/40.8=2.451A hesaplanır ve frekans ile zaman grafiklerinde aynen okunur.
* 2.3.4 • DC devrelerde güç, devre gerilimine ve devrede dolaşan akıma bağlıdır. AC devrelerde ise güç, endüktif ve kapasitif yük-
*     lerin de bulunması, akım ve gerilimin genliğinin devamlı olarak değişmesi ve aralarında faz farkı bulunması nedeniyle birden
*     fazla bileşene sahiptir, bunlar: aktif güç, reaktif güç ve görünür güçtür. Aktif güç P=I*R*cos(Fi) WattW, devredeki R üzerinde
*     harcanan enerjinin ölçüsüdür (Fi: akımla gerilim arasındaki faz farkı). AC devrelerde enerji kaynağına bobin ve sığaçtan geri
*     aktarılan güç reaktif güçtür, Q=V*I*sin(Fi) VAR. Görünür (bileşke) güç S=V*I VA'dir.
*     Örn.230V 50Hz sin kaynağa bağlı motor Im=10A ve akım Fi=30D takipeden ise, aktif güç P=I*V*cosFi=10*230*cos(-30*pi/
*     180)=1992 W, reaktif güç=V*I*sinFi=230*10*sin(-30*pi/180)=(-)1150 VAR, bileşke güç S=V*I=230*10=2300 VA.
* 2.3.5 • Tüm pratik bobinler R-Xl bileşiimidir. Örn.sağdaki V11  seri R-Xl devrede I=230/sqrt(60**2+50.27**2)=2.94A, güçler: P=
*     I**2*R=2.94**2*60=518.6W, Q=I**2*Xl=2.194**2*50.27=434.5VAR, S=I**2*Z=2.194**2*sqrt(60**2+50.27**2)=
*     2.94**2*78.3=676.8VA hesaplanır. Vektörel i=230/(60+50.27j)=2.25-1.9j=2.94<-40D A okunur. Güç üçgeni: P-Q-S<40D:
*     518.6W-434.5VAR -676.8VA (yatay-dikey-hipotenüs) çizilir. Açı Fi=acos(P/S)*180/pi=acos(518.6/676.8)*180/pi=40D.
*     Örn.sağdaki V12 paralel R-Xl devrede: Z=R*Xl/sqrt(R**2+Xl**2)=60*50.27/sqrt(60**2+50.27**2)=38.53Ω, I=V/Z=230/
*     38.53=5.97<-50DA, ancak Ir ve Ixl farklıdır: Ir=5.97*50.27/(60+50.27), Ixl=5.97*60/110.27, yada doğrudan aynı V ile
*     hesaplanır. P=Ir**2*R=V**2/R=230**2/60=881.67W, Q=Ixl**2*Xl=V**2/Xl=230**2/50.27=1052VAR, S=I**2*Z=V**2/Z
*     =230**2/38.53=1373VA, Fi=acos(881.6/1373)*180/pi50D. güç üçgeni: P-Q-S<D: 881.67W-1052VAR-1373VA<50D çizilir.
* 2.3.6 • Endüstride kullanılan yüklerin çoğunluğunu bobinli, yani endüktif devreler olup geri güç katsayılıdır (cos(Fi)=P/S < 1).
*     İş yapma özelliği olmayan reaktif güç, şebekeleri gereksiz yere yükler ve verimini düşürür. Bu yüzden güç katsayısının düzeltilmesi
*     (telafi, kompanzasyon), yani endüktif reaktif gücü yok etmek için devreye çoğunlukla paralel kondansatör grupları bağlanabilir.
*     Güç katsayısının 1’e yakın bir olması istenir. Bunun anlamı aktif güç R ile görünür gücün S birbirine yakın ve reaktif gücün ise
*     nispeten küçük olmasının istenmesidir. Bir sistemin güç katsayısı artırılarak sistemin verimi artırılır.
* 2.3.7 • Eğer bir alternatör, birbirinin aynısı ancak aralarında 120 derece faz farkı olan sinüs şekline sahip üç farklı sinyal üretiyorsa
*     buna üç fazlı sistem denir. Üretim ve iletimde 3 fazın avantajları: 1) Aynı boyuta sahip üç fazlı alternatörler bir fazlı olandan daha
*     fazla güç verir. 2) Çok fazlı alternatörlerde kilowatt–saat başına enerjinin maliyeti bir fazlıdan daha düşüktür. 3) Üç fazlı enerji
*     iletim hatları bir fazlı bakır hatlardan 3/4 daha hafif ve ucuzdur.
*     • R, S ve T bobinlerinin sarım sayıları birbirine eşit olursa indüklenen faz gerilimlerin maksimum değerleri, dolayısıyla bu gerilim-
*     lerin etkin değerleri de bir birine eşit olur. 120 derece faz farklı ve maksimum değeri aynı olan üç eğri matematiksel olarak şöyle
*     ifade edilir. er=Em.sin(wt), es=Em.sin(wt+2pi/3), et=Em.sin(wt-2pi/3). Alternatörlerde gerilim indüklenmesini sağlamak için kulla-
*     nılan bobinler birbirlerine iki farklı şekilde bağlanır. Bunlar yıldız (Y) ve üçgen (Dlt) bağlantılardır. Her bir bobinde indüklenen
*     gerilim faz gerilimi, fazlar arasındaki gerilim ise hat gerilimi olarak isimlendirilir. Yıldız bağlantıda Vh=Vf*sqrt(3)=230*1.732=
*     398.37-->400V, Ih=If; üçgen bağlantıda Vh=Vf, Ih=If*sqrt(3)'dür. Yıldız bağlantıda yükler ortak sıfır noktası ile bir faz ucuna
*     bağlanır. Üçgen bağlantıda ise sıfır noktası yoktur, yükler faz uçları arasına bağlanır.
*     • Üç fazlı sistemin yıldız ve üçgen bağlantılarda eğer dengeli yük (eşit Z empedanslı yükler: Zr=Zs=Zt) varsa güç P=sqrt(3)*Vh*Ih
*     *cos(Fi) hesaplanır.
*     Örn.sağdaki yıldız V13 dengeli devrede Y-Yıldız bağlantıda, Vhat=3^0.5Vfaz=1.7321*230=398.37V, Ihat=Ifaz=230/50=4.6A, Pyük
*     =Vf*If=1.058kW
*     Örn.sağdaki üçgen V16 dengeli devrede Delta bağlantıda, Vhat=Vfaz=230V, Ihat=Ifaz*3^0.5, If=230/50=4.6A, Ih=sqrt(3)*4.6=
*     7.97A, Pyük=Vf*If=1.058kW hesaplanır ve simülasyonda okunur.
*     • Örn.Sağdaki V19 seri R-L-C devrede Z=40+8.63j=40.92<12.17D, I=V/Z=0.239-0.052j=244.4<-12.17DA, R-X-Z=40-8.63-40.92Ω
*     <12.2D hesaplanır.
*     • Örn.Sağdaki V20 paralel R-L-C devrede Z=1/(1/40+1/(2*pi*50*40e-3j)+(2*pi*50*30e-3j))=0.000286-0.107j=0.107<-89.85DΩ,
*     I=3+1121j=1121<89.85DA, R-X-Z-D=286u-107m-107mΩ--89.85D hesaplanır.
*     • Örn.Sağdaki V21 seri R-L-C rezonans devrede fr=1/(2*pi*sqrt(40e-3*8e-3))=8.9Hz, Q=fr/BG=Xl/R, bg=fr.R/Xl=8.9*30/(2*pi*8.9*
*     40e-3)=119.37Hz, f1k=fr-bg/2=8.89-119.37/2=-51?-->660mHz, f2k=fr-bg/2=8.89+119.37/2=68.6?-->120Hz görülür.
*     • Örn.Sağdaki V22 paralel R-L-C rezonans devrede fr=1/(2*pi*sqrt(30e-3*20e-3)=6.5Hz, bg=fr*R/Xl=6.5*30/(2*pi*6.5*30e-3)=
*     159.2Hz, fk1=6.5-159.2/2=-?-->Hz, fk2=86.1Hz (Z mΩ düşük, I kA yüksek olunca Bode-Linear grafik şaşırmakta, ancak Bode-
*     Decibel'de fr=6.5Hz görülmektedir).
*     • Örn.380V asenkron motor I=7<-15D A ise kaynaktan çekilen aktif-güç P=380*7*cos(-15*pi/180)=2.57kW, reaktif-güç Q=380*
*     8*sin(-15*pi/180)=787VAR, gerçek-güç S=380*7=2.66kVA hesaplanır.
*     • Örn.400V asenkron motor Im=5A<-5D ise P=400*5*cos(5*pi/180)=1.993kW, Q=400*5*sin(5*pi/180)=174VAR, S=400*5=2kVA
*     • Örn.V=110V, f=50Hz, I=2A, seri R=70Ω, Xl=50Ω ise P-Q-S-D: P=I**2*R=2**2*70=280W, Q=I**2*Xl=2**2*50=200VAR, S=I**2
*     *Z=2**2*sqrt(70**2+50**2)=344VA, D=atan(Xl/R)*180/pi=atan(50/70)*180/pi=asin(200/344)*180/pi=acos(280/344)*180/pi=
*     35.5D güç-üçgeni hesaplanır.
*     • Örn.V=100V, f=50Hz, I=3A, paralel R=40Ω, Xl=50Ω ise P-Q-S-D: P=V**2/R=100**2/40=250W, Q=V**2/Xl=100**2/50=200VAR,
*     Z=40*50/sqrt(40**2+50**2)=31.2, S=V**2/Z=100**2/31.2=450 sqrt(P**2+Q**2)=sqrt(250**2+200**2)=340VA, D=atan(4/5)*
*     180/pi=38.66D güç-üçgeni hesaplanır.
*     • Örn.V=220V, f=60Hz, I=4A, seri R=80Ω, Xl=90Ω ise güç-katsayısı=gk=cos(Fi)=P/S=4**2*80/(4**2*sqrt(80**2+90**2))=0.66-->
*      Fi=atan(90/80)*180/pi=48.37D, cos(Fi)=cos(48.37*pi/180)=0.66 hesaplanır.
*     • Örn.Seri R-L-C devresinde R=15, Xl=24, Xc=4Ω, Ve=100V ise Ie=Ve/sqrt(R**2+(Xl-Xc)**2)=100/sqrt(15**2+(24-4)**2)=4A
*     • Örn.Vr/Vxc=3/4, ise atan(4/3)*180/pi=53.13D, cos(Fi)=cos(53.13*pi/180)=0.6=3/5=gk
;tran 200mS startup
;ac lin 1000 1Hz 2kHz
;tran 12mS startup
;ac lin 1000 1Hz 1kHz
;tran 300mS startup
;tran 200mS startup
* Xl=50.27Ω
* Yük
* Yük
* Xl=50.27Ω
* Yıldız
* Üçgen
;ac lin 1000 0.001Hz 200Hz
.ac lin 1000 0.001Hz 100Hz
.backanno
.end